# EAGLE design layout (EAGLE 9.5.1)
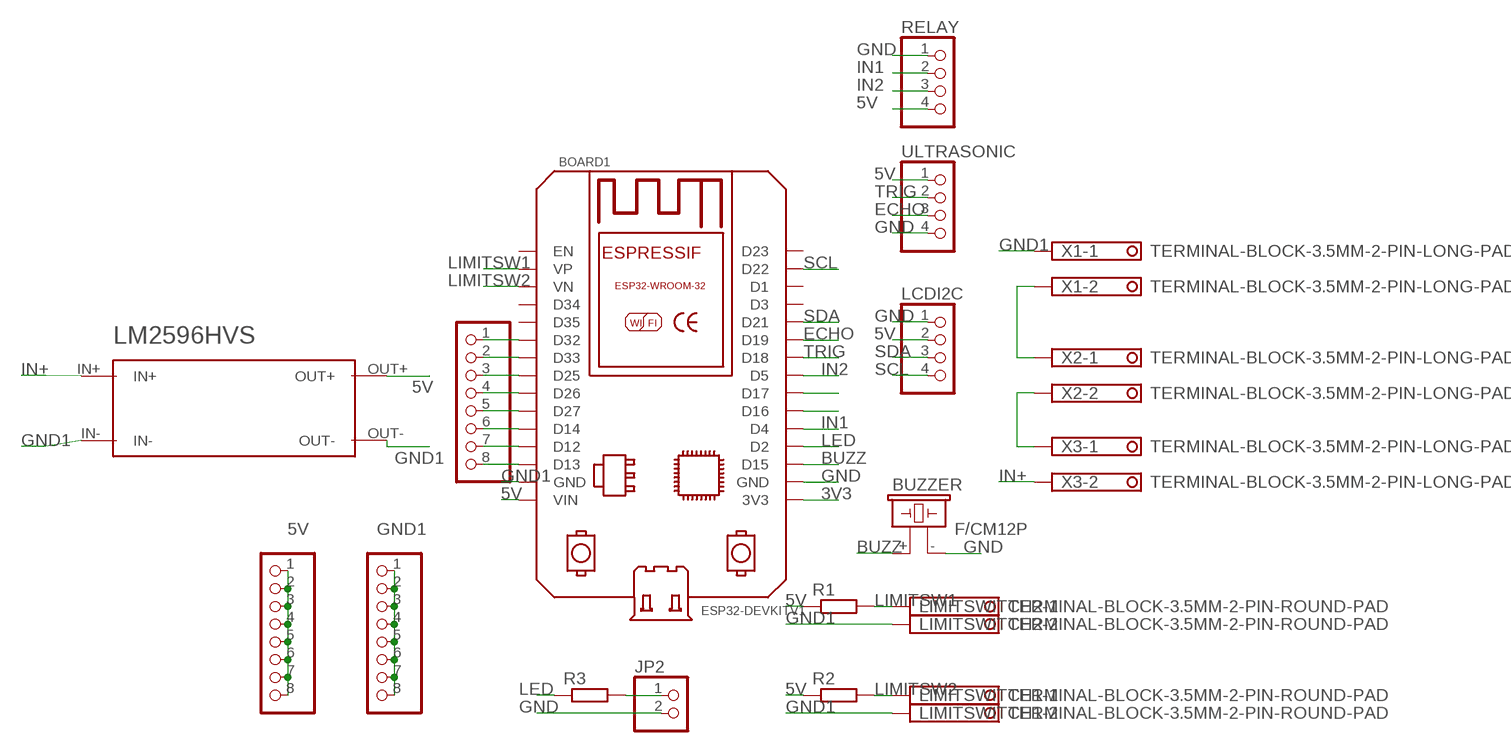
[diagram p0: schematic, sheet 1]

## Parts
BOARD1  ESP32DEVKITV1SHRIDATTDUDHAT  [ESP32-DEVKITV1]
BUZZER  F/CM12P  [F/CM12P]
JP1  PINHD-1X8  [1X08]
JP2  PINHD-1X2  [1X02]
JP3  PINHD-1X8  [1X08]
JP4  PINHD-1X8  [1X08]
LCDI2C  PINHD-1X4  [1X04]
LIMITSWITCH1  TERMINAL-BLOCK-3.5MM-2-PIN-ROUND-PAD  [TERMINAL-BLOCK-2-PIN-3.5MM-ROUND-PAD]
LIMITSWITCH2  TERMINAL-BLOCK-3.5MM-2-PIN-ROUND-PAD  [TERMINAL-BLOCK-2-PIN-3.5MM-ROUND-PAD]
R1  R-EU_0207/10  [0207/10]
R2  R-EU_0207/10  [0207/10]
R3  R-EU_0207/10  [0207/10]
RELAY  PINHD-1X4  [1X04]
STEP_DOWN1  LM2596HVS  [LM2596HVS]
ULTRASONIC  PINHD-1X4  [1X04]
X1  TERMINAL-BLOCK-3.5MM-2-PIN-LONG-PAD  [TERMINAL-BLOCK-2-PIN-3.5MM-LONG-PAD]
X2  TERMINAL-BLOCK-3.5MM-2-PIN-LONG-PAD  [TERMINAL-BLOCK-2-PIN-3.5MM-LONG-PAD]
X3  TERMINAL-BLOCK-3.5MM-2-PIN-LONG-PAD  [TERMINAL-BLOCK-2-PIN-3.5MM-LONG-PAD]

## Nets
3V3: BOARD1.3V3
5V: BOARD1.VIN JP3.1 JP3.2 JP3.3 JP3.4 JP3.5 JP3.6 JP3.7 JP3.8 LCDI2C.2 R1.1 R2.1 RELAY.4 STEP_DOWN1.OUT+ ULTRASONIC.1
BUZZ: BOARD1.D15 BUZZER.+
ECHO: BOARD1.D19 ULTRASONIC.3
GND: BOARD1.GND@1(GND) BUZZER.- JP2.2 LCDI2C.1 RELAY.1 ULTRASONIC.4
GND1: BOARD1.GND JP4.1 JP4.2 JP4.3 JP4.4 JP4.5 JP4.6 JP4.7 JP4.8 LIMITSWITCH1.2 LIMITSWITCH2.2 STEP_DOWN1.IN- STEP_DOWN1.OUT- X1.1
IN1: BOARD1.D4 RELAY.2
IN2: BOARD1.D5 RELAY.3
IN+: STEP_DOWN1.IN+ X3.2
LED: BOARD1.D2 R3.1
LIMITSW1: BOARD1.VP LIMITSWITCH2.1 R1.2
LIMITSW2: BOARD1.VN LIMITSWITCH1.1 R2.2
N$1: JP2.1 R3.2
N$2: X1.2 X2.1
N$3: X2.2 X3.1
N$5: BOARD1.D13 JP1.8
N$6: BOARD1.D12 JP1.7
N$7: BOARD1.D14 JP1.6
N$8: BOARD1.D27 JP1.5
N$9: BOARD1.D26 JP1.4
N$10: BOARD1.D25 JP1.3
N$11: BOARD1.D33 JP1.2
N$12: BOARD1.D32 JP1.1
N$16: BOARD1.D17
N$17: BOARD1.D16
SCL: BOARD1.D22 LCDI2C.4
SDA: BOARD1.D21 LCDI2C.3
TRIG: BOARD1.D18 ULTRASONIC.2
Unconnected: BOARD1.D1 BOARD1.D3 BOARD1.D23 BOARD1.D34 BOARD1.D35 BOARD1.EN

## Library data of the parts
BOARD1 = ESP32-DEVKITV1:ESP32DEVKITV1: https://github.com/shridattdudhat
BUZZER = buzzer:F/CM12P: BUZZER Source: Buerklin; OC_FARNELL: unknown; OC_NEWARK: unknown
JP1 JP3 JP4 = pinhead:PINHD-1X8: PIN HEADER
JP2 = pinhead:PINHD-1X2: PIN HEADER
LCDI2C RELAY ULTRASONIC = pinhead:PINHD-1X4: PIN HEADER
LIMITSWITCH1 LIMITSWITCH2 X1-X3 = Rembrandt Electronics - Terminal Block 3-5mm v1-0:TERMINAL-BLOCK-3.5MM-2-PIN: Terminal Block 3.5mm Pitch: 3,5 mm Number of pins: 2 Created by Rembrandt Electronics www.rembrandtelectronics.com
R1-R3 = rcl:R-EU_: RESISTOR, European symbol; SPICEPREFIX: R
STEP_DOWN1 = SCM:LM2596HVS

## Board
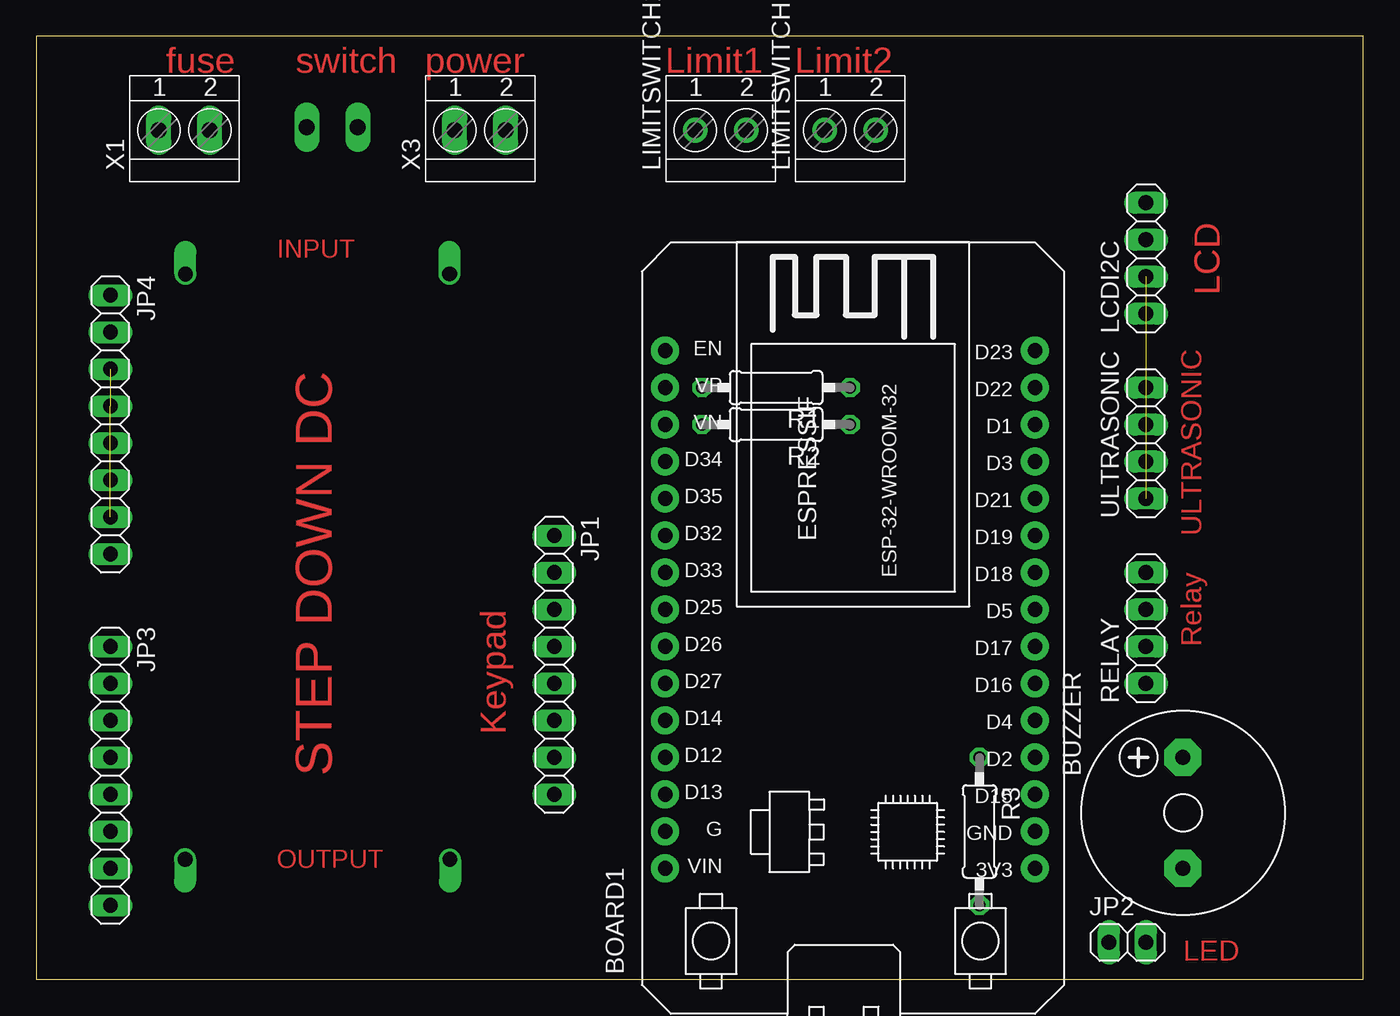
[diagram p1: board, top side]
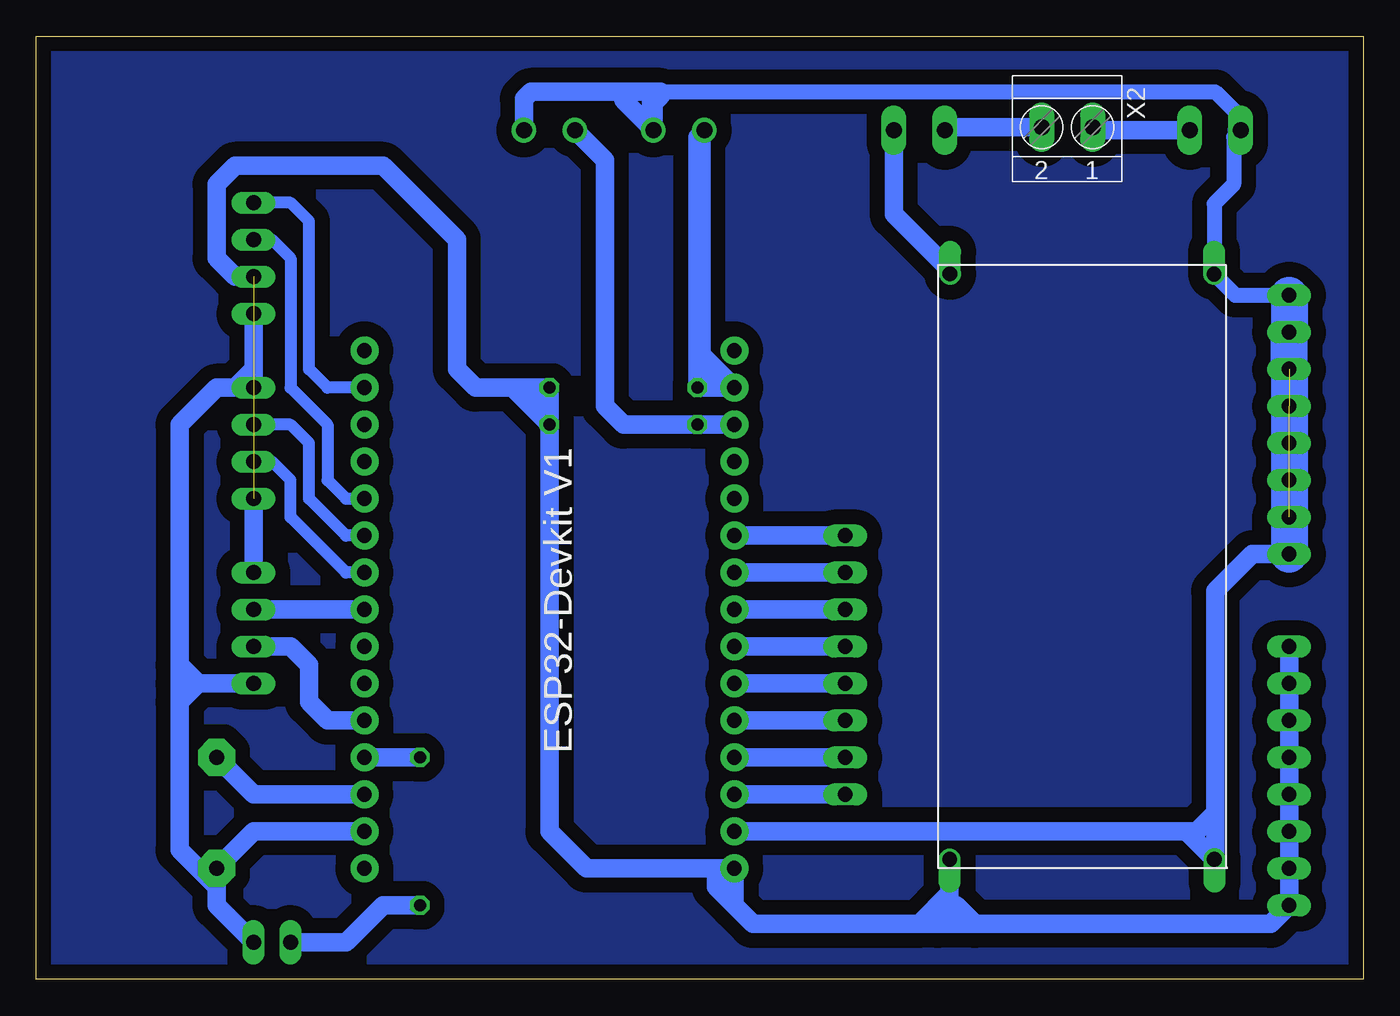
[diagram p2: board, bottom side, seen from below]

Size 91.11 x 64.76 mm. Coordinates in mm from the lower left corner, seen from the top.
Outline: 0,0 91.11,0 91.11,64.76 0,64.76 0,0
Copper layers (1*16): Top 0.035mm / dielectric 1.5mm / Bottom 0.035mm
Design rules "default": minimum track width 6mil, minimum drill 0.35mm, track to track 6mil, track to pad 6mil, pad to pad 6mil, via to via 6mil, smd to smd 6mil, copper to edge 40mil, drill to drill 6mil, minimum pad ring 10mil, minimum via ring 8mil, stop-mask expansion 4mil, vias tented up to drill 0mil, thermal gap 10mil

### Footprints (pad centres in the part's own frame; a part is rotated, then mirrored left to right if it is on the bottom)
ESP32-DEVKITV1 = drill 1 pad 1.93: 3V3 0,0; D1 30.48,0; D2 7.62,0; D3 27.94,0; D4 10.16,0; D5 17.78,0; D12 7.62,25.4; D13 5.08,25.4; D14 10.16,25.4; D15 5.08,0; D16 12.7,0; D17 15.24,0; D18 20.32,0; D19 22.86,0; D21 25.4,0; D22 33.02,0; D23 35.56,0; D25 17.78,25.4; D26 15.24,25.4; D27 12.7,25.4; D32 22.86,25.4; D33 20.32,25.4; D34 27.94,25.4; D35 25.4,25.4; EN 35.56,25.4; GND 2.54,25.4; GND@1 2.54,0; VIN 0,25.4; VN 30.48,25.4; VP 33.02,25.4
F/CM12P = drill 1.016 pad 2.54 octagon: + 3.81,0; - -3.81,0
1X08 = drill 1.016 long: 1 -8.89,0; 2 -6.35,0; 3 -3.81,0; 4 -1.27,0; 5 1.27,0; 6 3.81,0; 7 6.35,0; 8 8.89,0
1X02 = drill 1.016 long: 1 -1.27,0; 2 1.27,0
1X04 = drill 1.016 long: 1 -3.81,0; 2 -1.27,0; 3 1.27,0; 4 3.81,0
TERMINAL-BLOCK-2-PIN-3.5MM-ROUND-PAD = drill 1.1 pad 1.7: 1 -1.75,-0.1; 2 1.75,-0.1
0207/10 = drill 0.813 octagon: 1 -5.08,0; 2 5.08,0
LM2596HVS = drill 1.016 offset: IN+ 33.212,1.701; IN- 33.196,-16.436; OUT+ -7.009,1.727; OUT- -7.001,-16.461
TERMINAL-BLOCK-2-PIN-3.5MM-LONG-PAD = drill 1.1 pad 1.7 long: 1 -1.75,-0.1; 2 1.75,-0.1

### Placement (x,y rotation side)
BOARD1  68.58,7.62 90 top
BUZZER  78.74,11.43 90 top
JP1  35.56,21.59 270 top
JP2  74.93,2.54 0 top
JP3  5.08,13.97 270 top
JP4  5.08,38.1 270 top
LCDI2C  76.2,49.53 90 top
LIMITSWITCH1  55.88,58.42 0 top
LIMITSWITCH2  46.99,58.42 0 top
R1  50.8,40.64 180 top
R2  50.8,38.1 180 top
R3  64.77,10.16 270 top
RELAY  76.2,24.13 90 top
STEP_DOWN1  26.67,15.24 90 bottom
ULTRASONIC  76.2,36.83 90 top
X1  10.16,58.42 0 top
X2  20.32,58.42 180 bottom
X3  30.48,58.42 0 top

### Tracks (layer width: path | path; a pad name or v marks a point on that pad's centre or on a via)
5V  (1 unrouted)
  Bottom 0.813: 55.88,39.37 R1.1 57.15,40.64 58.42,40.64 | LCDI2C.2 77.47,48.26
  Bottom 1.27: R2.1 R1.1 58.42,40.64 | R2.1 55.88,39.37 57.15,40.64 | 58.42,40.64 60.96,40.64 62.23,41.91 62.23,50.8 67.31,55.88 77.47,55.88 78.74,54.61 78.74,49.53 77.47,48.26 | R2.1 55.88,10.16 53.34,7.62 44.45,7.62 | 44.45,7.62 BOARD1.VIN 43.18,5.08 | R2.1 58.42,40.64 | 43.18,5.08 41.91,3.81 30.48,3.81 | 43.18,5.08 44.45,6.35 44.45,7.62 | 26.67,3.81 6.35,3.81 JP3.8 JP3.7 JP3.6 JP3.5 JP3.4 JP3.3 JP3.2 JP3.1 | 29.21,3.81 30.48,3.81 | 28.4,5.08 28.4,5.89 | 28.4,5.89 STEP_DOWN1.OUT+ | 26.67,3.81 27.94,5.08 28.4,5.08 | 28.4,5.08 28.4,4.62 29.21,3.81 | 26.67,3.81 29.21,3.81 | 30.48,3.81 28.4,5.89 | ULTRASONIC.1 RELAY.4
BUZZ
  Bottom 1.27: BOARD1.D15 76.2,12.7 BUZZER.+
ECHO
  Bottom 0.813: BOARD1.D19 69.85,30.48 72.39,33.02 72.39,36.83 73.66,38.1 ULTRASONIC.3
GND
  Bottom 0.813: RELAY.1 80.01,20.32 | ULTRASONIC.4 77.47,40.64 78.74,40.64
  Bottom 1.27: 76.2,41.91 ULTRASONIC.4 78.74,40.64 81.28,38.1 81.28,21.59 | 76.2,41.91 LCDI2C.1 | 76.2,41.91 77.47,40.64 | 81.28,21.59 81.28,20.32 | 81.28,20.32 81.28,19.05 | 81.28,19.05 81.28,8.89 80.01,7.62 | RELAY.1 81.28,20.32 | 81.28,21.59 80.01,20.32 81.28,19.05 | JP2.2 78.74,5.08 78.74,6.35 | 78.74,6.35 BUZZER.- | BOARD1.GND@1 76.2,10.16 BUZZER.- | BUZZER.- 80.01,7.62 | 80.01,7.62 78.74,6.35
GND1  (4 unrouted)
  Bottom 0.813: LIMITSWITCH2.2 48.74,60.17 48.89,60.33 49.53,60.96 | 49.53,60.96 50.8,60.96 | 49.53,60.96 48.26,60.96
  Bottom 1.016: 8.79,58.32 X1.1 | X1.1 8.41,59.21 10.16,60.96 48.26,60.96 | X1.1 8.89,57.84 8.89,54.61 10.23,53.27 STEP_DOWN1.IN- 8.79,46.99 JP4.1
  Bottom 1.27: 48.26,60.96 48.26,60.65 48.74,60.17 | 48.89,60.33 48.89,58.48 LIMITSWITCH2.2 | LIMITSWITCH2.2 48.74,60.48 48.26,60.96 | 48.26,60.96 50.8,60.96 | 50.8,60.96 57.15,60.96 57.63,60.48 LIMITSWITCH1.2 | 12.13,10.16 STEP_DOWN1.OUT- 10.21,7.67 10.16,7.62 10.16,11.43 | 12.13,10.16 BOARD1.GND | JP4.8 7.62,29.21 10.16,26.67 10.16,11.43 | 12.13,10.16 11.43,10.16 10.16,11.43 | LIMITSWITCH2.2 50.8,60.38 50.8,60.96
  Bottom 2.54: JP4.8 JP4.3 JP4.2 JP4.1
IN1
  Bottom 1.27: BOARD1.D4 71.12,17.78 72.39,19.05 72.39,21.59 73.66,22.86 RELAY.2
IN2
  Bottom 1.27: BOARD1.D5 RELAY.3
IN+
  Bottom 1.27: STEP_DOWN1.IN+ 28.37,48.69 32.23,52.55 X3.2
LED
  Bottom 1.27: R3.1 BOARD1.D2
LIMITSW1
  Bottom 0.813: LIMITSWITCH2.1 45.24,41.91 45.24,41.12 R1.2
  Bottom 1.27: BOARD1.VP 44.45,41.91 45.24,41.91 | BOARD1.VP R1.2 45.72,43.18 | 45.72,43.18 45.72,57.84 LIMITSWITCH2.1 | BOARD1.VP 45.72,43.18
LIMITSW2
  Bottom 1.27: LIMITSWITCH1.1 52.07,56.26 52.07,39.37 50.8,38.1 R2.2 BOARD1.VN
N$1
  Bottom 1.27: R3.2 67.31,5.08 69.85,2.54 JP2.1
N$2
  Bottom 1.016: 18.37,58.32 X2.1
  Bottom 1.27: X1.2 18.37,58.32
N$3
  Bottom 1.27: X2.2 28.53,58.52 X3.1
N$4
  pour Bottom (isolate 1.016): 0,1.27 1.27,0 91.44,0 91.44,63.5 88.93,66.01 0,63.5
N$5
  Bottom 1.27: JP1.8 BOARD1.D13
N$6
  Bottom 1.27: JP1.7 BOARD1.D12
N$7
  Bottom 1.27: JP1.6 BOARD1.D14
N$8
  Bottom 1.27: JP1.5 BOARD1.D27
N$9
  Bottom 1.27: JP1.4 BOARD1.D26
N$10
  Bottom 1.27: JP1.3 BOARD1.D25
N$11
  Bottom 1.27: JP1.2 BOARD1.D33
N$12
  Bottom 1.27: JP1.1 BOARD1.D32
SCL
  Bottom 0.813: BOARD1.D22 71.12,40.64 72.39,41.91 72.39,52.07 73.66,53.34 LCDI2C.4
SDA
  Bottom 0.813: LCDI2C.3 74.93,50.8 73.66,49.53 73.66,40.64 71.12,38.1 71.12,34.29 69.85,33.02 BOARD1.D21
TRIG
  Bottom 0.813: BOARD1.D18 69.85,27.94 73.66,31.75 73.66,34.29 74.93,35.56 ULTRASONIC.2

### Text on the board
Top: fuse | switch | power | Limit1 | Limit2 | INPUT | LCD | ULTRASONIC | Keypad | Relay | STEP DOWN DC | OUTPUT | LED